# Altium project Velvet_Controller_V1.2_2023.PrjPcb (part 3 of 3)
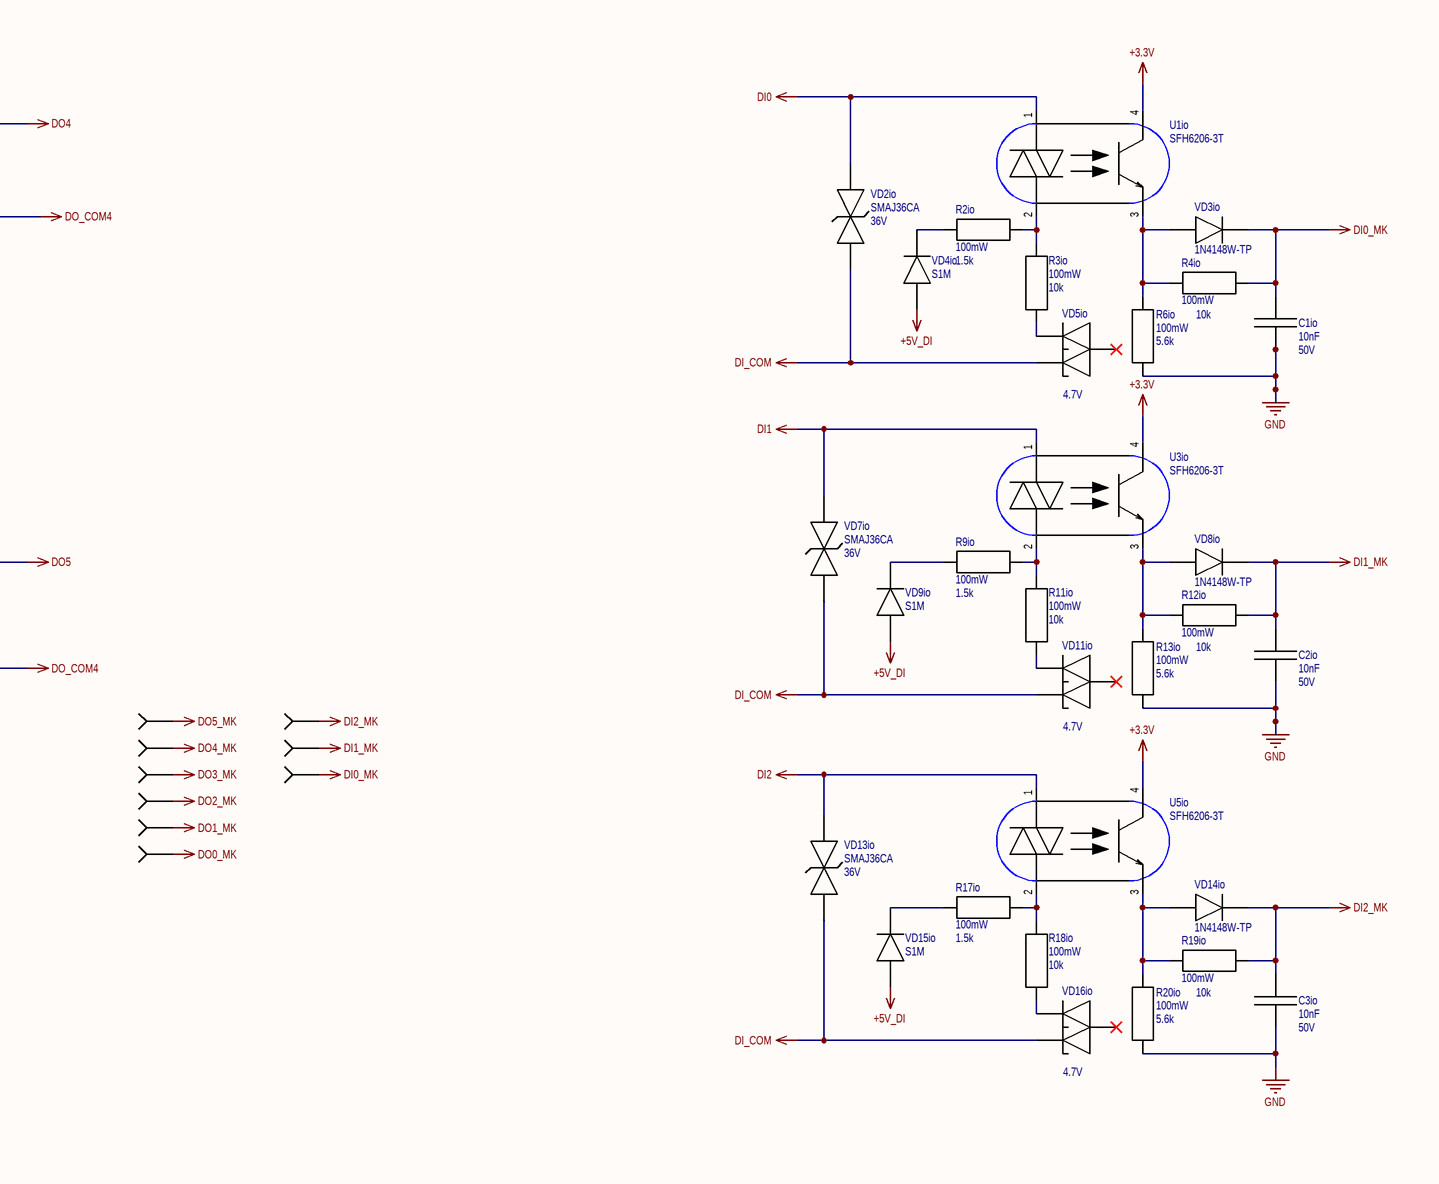
[diagram p8: Схема дискретных входов и выходов.SchDoc, right]

## Nets that join several sheets
+3.3V: Схема питания Velvet Controller (5 pins), Схема МК и датчиков Velvet Controller (47 pins), Схема LoRa и RFID Velvet Controller (14 pins), Схема Wi-Fi Velvet Controller (9 pins), Схема дискретных входов и выходов (U1io.4 U3io.4 U5io.4)
+4V: Схема питания Velvet Controller (6 pins), Схема GSM Velvet Controller (9 pins)
+5V: Схема питания Velvet Controller (7 pins), Схема LoRa и RFID Velvet Controller (6 pins)
+5V_DI: Схема питания Velvet Controller (C38p.1 DA5p.8 R13p.2), Схема дискретных входов и выходов (VD4io.2 VD9io.2 VD15io.2 X1io.8)
+12V: Схема питания Velvet Controller (19 pins), Схема МК и датчиков Velvet Controller (X3mc.3), Схема LoRa и RFID Velvet Controller (R15lr.2), Схема дискретных входов и выходов (K1io.1 K2io.1 VD1io.1 VD10io.1)
+PWR: Схема питания Velvet Controller (FU1p.1), Схема дискретных входов и выходов (X1io.1)
-PWR: Схема питания Velvet Controller (C4p.2 L1p.3 R2p.1 RU1p.1), Схема дискретных входов и выходов (X1io.2)
BOOT0_LoRa_MK: Схема МК и датчиков Velvet Controller (DD1mc.85), Схема LoRa и RFID Velvet Controller (JP1lr.2)
DI0_MK: Схема МК и датчиков Velvet Controller (DD1mc.39), Схема дискретных входов и выходов (C1io.1 R4io.1 TP6io.1 VD3io.1)
DI1_MK: Схема МК и датчиков Velvet Controller (DD1mc.40), Схема дискретных входов и выходов (C2io.1 R12io.1 TP4io.1 VD8io.1)
DI2_MK: Схема МК и датчиков Velvet Controller (DD1mc.41), Схема дискретных входов и выходов (C3io.1 R19io.1 TP2io.1 VD14io.1)
DO0_MK: Схема МК и датчиков Velvet Controller (DD1mc.97 R10mc.2), Схема дискретных входов и выходов (R1io.1 TP11io.1)
DO1_MK: Схема МК и датчиков Velvet Controller (DD1mc.98 R9mc.2), Схема дискретных входов и выходов (R10io.1 TP9io.1)
DO2_MK: Схема МК и датчиков Velvet Controller (DD1mc.1 R8mc.2), Схема дискретных входов и выходов (R21io.1 TP7io.1)
DO3_MK: Схема МК и датчиков Velvet Controller (DD1mc.2 R7mc.2), Схема дискретных входов и выходов (R24io.1 TP5io.1)
DO4_MK: Схема МК и датчиков Velvet Controller (DD1mc.3 R6mc.2), Схема дискретных входов и выходов (R7io.2 TP3io.1 VT1io.1)
DO5_MK: Схема МК и датчиков Velvet Controller (DD1mc.4 R5mc.2), Схема дискретных входов и выходов (R15io.2 TP1io.1 VT3io.1)
ESP_EN: Схема МК и датчиков Velvet Controller (DD1mc.25), Схема Wi-Fi Velvet Controller (DD1wf.45 R1wf.1 VT1wf.3)
ESP_MK_RX: Схема МК и датчиков Velvet Controller (DD1mc.23), Схема Wi-Fi Velvet Controller (DD1wf.22)
ESP_MK_TX: Схема МК и датчиков Velvet Controller (DD1mc.24), Схема Wi-Fi Velvet Controller (DD1wf.21)
GND: Схема питания Velvet Controller (43 pins), Схема МК и датчиков Velvet Controller (63 pins), Схема LoRa и RFID Velvet Controller (26 pins), Схема Wi-Fi Velvet Controller (55 pins), Схема GSM Velvet Controller (37 pins), Схема дискретных входов и выходов (14 pins)
GND_DI: Схема питания Velvet Controller (5 pins), Схема дискретных входов и выходов (X2io.1)
GSM_EN: Схема МК и датчиков Velvet Controller (DD1mc.57), Схема GSM Velvet Controller (R15gs.2 TP5gs.1 VT3gs.1)
GSM_STATUS: Схема МК и датчиков Velvet Controller (DD1mc.56), Схема GSM Velvet Controller (DD1gs.42 R13gs.2 TP6gs.1 VT1gs.1)
LoRa_UART2_RX: Схема МК и датчиков Velvet Controller (DD1mc.68), Схема LoRa и RFID Velvet Controller (DD2lr.1)
LoRa_UART2_TX: Схема МК и датчиков Velvet Controller (DD1mc.69), Схема LoRa и RFID Velvet Controller (DD2lr.2)
MK_GSM_RX: Схема МК и датчиков Velvet Controller (DD1mc.48), Схема GSM Velvet Controller (R8gs.2 TP4gs.1)
MK_GSM_TX: Схема МК и датчиков Velvet Controller (DD1mc.47), Схема GSM Velvet Controller (R9gs.2 TP2gs.1)
MK_To_RFID_EN: Схема МК и датчиков Velvet Controller (DD1mc.67), Схема LoRa и RFID Velvet Controller (R5lr.1 VT3lr.1 VT3lr.2)
MK_To_RFID_GPI: Схема МК и датчиков Velvet Controller (DD1mc.61), Схема LoRa и RFID Velvet Controller (R3lr.1 VT2lr.1 VT2lr.2)
MK_To_RFID_GPO: Схема МК и датчиков Velvet Controller (DD1mc.62), Схема LoRa и RFID Velvet Controller (R8lr.1 R10lr.2)
MK_to_RFID_RX: Схема МК и датчиков Velvet Controller (DD1mc.64), Схема LoRa и RFID Velvet Controller (R9lr.1 R11lr.2)
MK_to_RFID_TX: Схема МК и датчиков Velvet Controller (DD1mc.63), Схема LoRa и RFID Velvet Controller (R1lr.1 VT1lr.1 VT1lr.2)
NRST_LoRa: Схема МК и датчиков Velvet Controller (DD1mc.84), Схема LoRa и RFID Velvet Controller (C6lr.1 DD2lr.22 R7lr.1 X1lr.1)
PE: Схема питания Velvet Controller (C2p.1 C8p.2), Схема МК и датчиков Velvet Controller (X3mc.5), Схема дискретных входов и выходов (X1io.3)
RFID_HEAT: Схема МК и датчиков Velvet Controller (DD1mc.60), Схема LoRa и RFID Velvet Controller (R16lr.2)
TS1_ALERT: Схема МК и датчиков Velvet Controller (DD1mc.91), Схема LoRa и RFID Velvet Controller (DD3lr.3 R18lr.1)
TS_SCL: Схема МК и датчиков Velvet Controller (DD1mc.95 DD2mc.1 R2mc.1 X5mc.2), Схема LoRa и RFID Velvet Controller (DD3lr.1 R19lr.1)
TS_SDA: Схема МК и датчиков Velvet Controller (DD1mc.93 DD2mc.6 R3mc.1 X5mc.1), Схема LoRa и RFID Velvet Controller (DD3lr.6 R20lr.1)